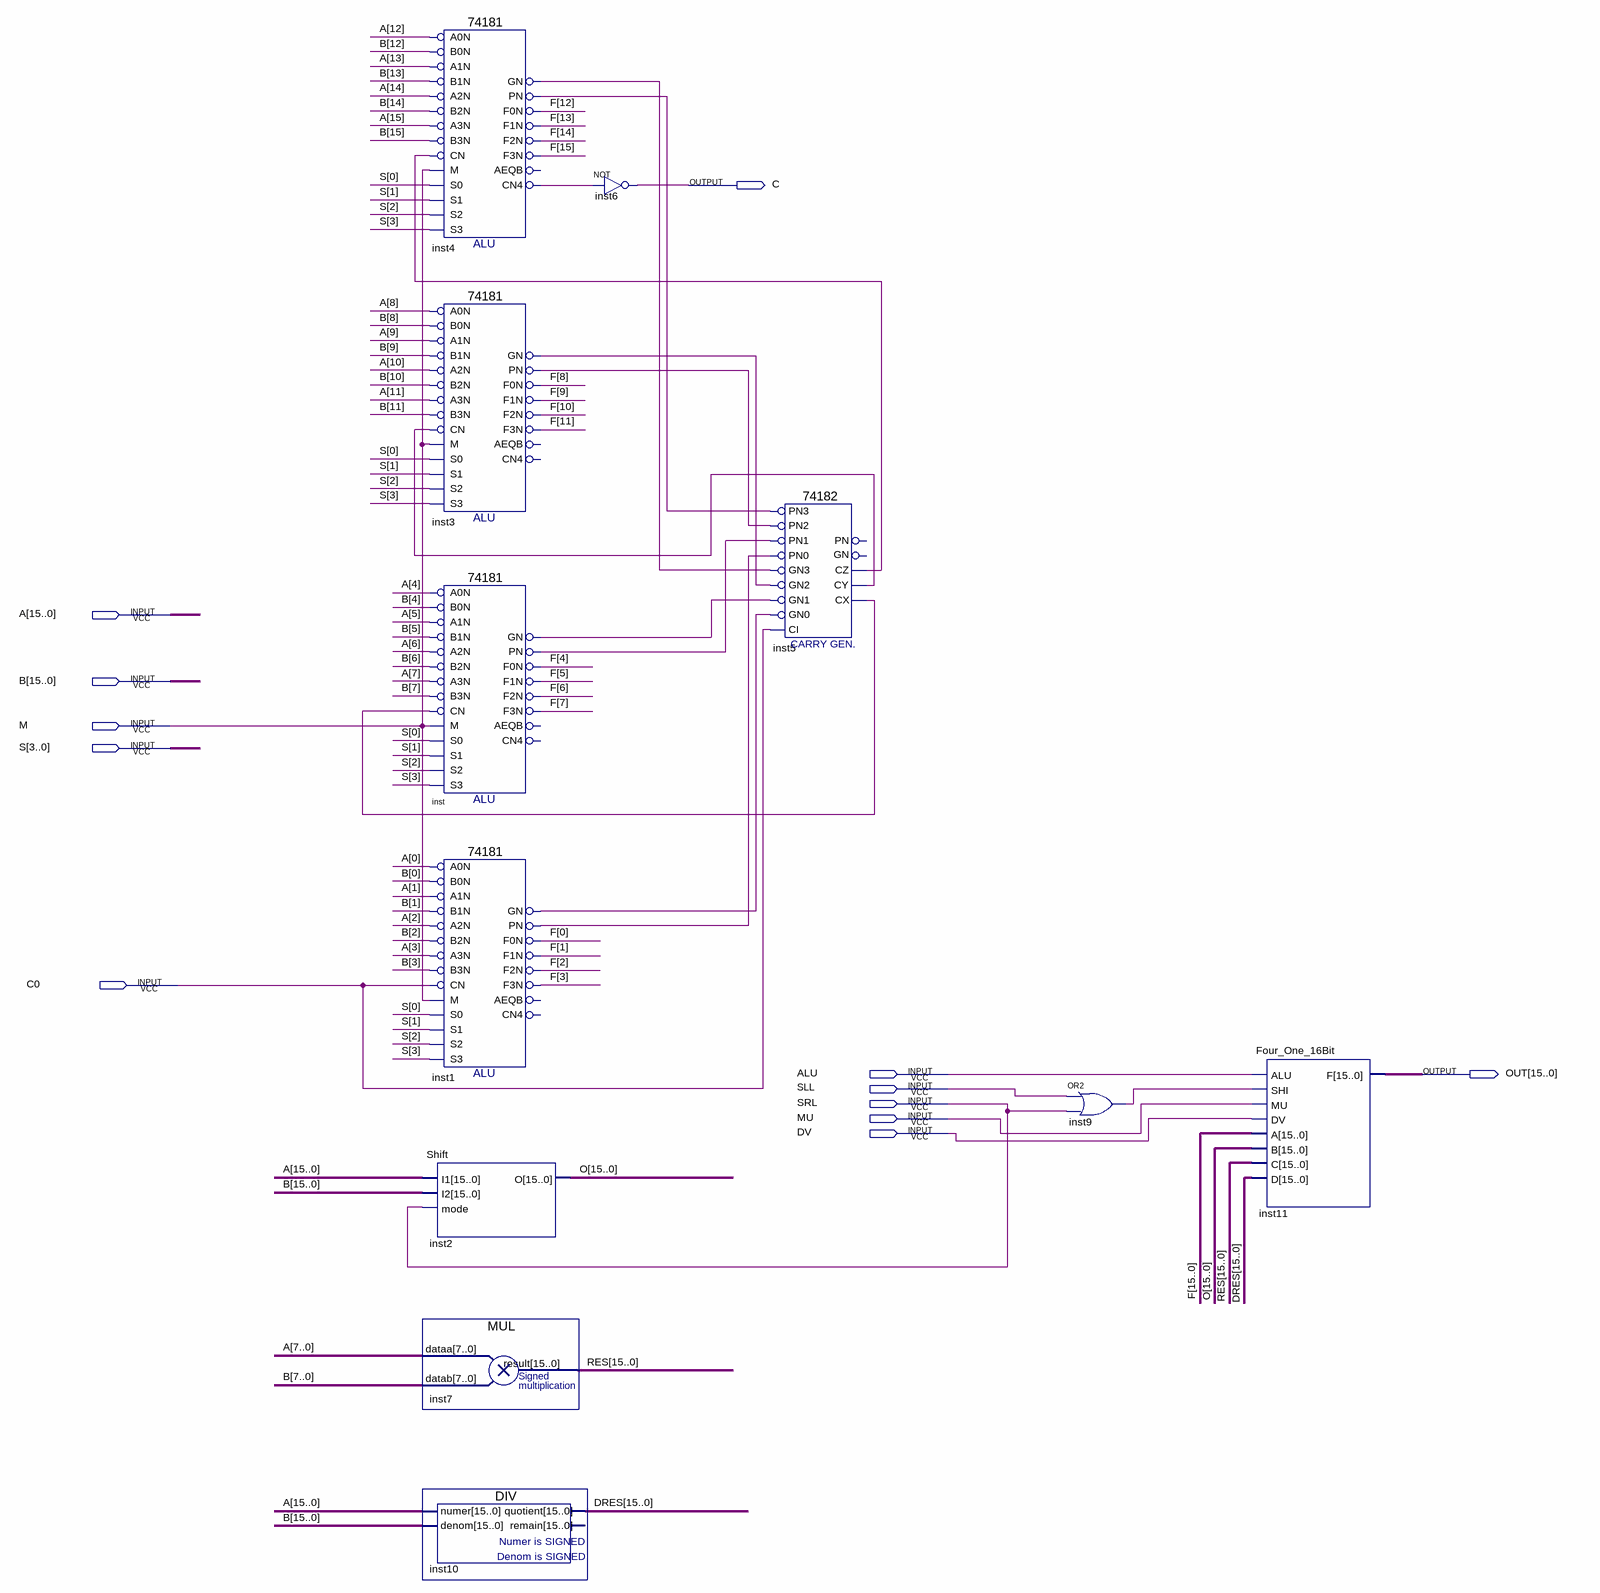
[diagram p0: schematic sheet]
// Quartus schematic 16_Bit_ALU.bdf as structural Verilog: 11 symbols, 12 pins
module \16_Bit_ALU  (
  input  [15:0] A,
  input  [15:0] B,
  input  M,
  input  [3:0] S,
  input  C0,
  input  ALU,
  input  SLL,
  input  SRL,
  input  MU,
  input  DV,
  output C,
  output [15:0] OUT
);

  wire inst1_gn, inst1_pn, inst3_gn, inst3_pn, inst4_cn4, inst4_gn, inst4_pn, inst5_cx, inst5_cy, inst5_cz,
       inst9_out, inst_gn, inst_pn;
  wire [15:0] DRES, F, O, RES;

  \74181  inst4 (
    .B0N(B[12]), .A0N(A[12]), .A1N(A[13]), .B1N(B[13]), .A3N(A[15]), .B2N(B[14]), .A2N(A[14]), .M(M),
    .CN(inst5_cz), .B3N(B[15]), .S2(S[2]), .S1(S[1]), .S0(S[0]), .S3(S[3]), .PN(inst4_pn), .GN(inst4_gn),
    .F3N(F[15]), .F1N(F[13]), .F0N(F[12]), .CN4(inst4_cn4), .F2N(F[14]));  // open: AEQB
  \74181  inst3 (
    .B0N(B[8]), .A0N(A[8]), .A1N(A[9]), .B1N(B[9]), .A3N(A[11]), .B2N(B[10]), .A2N(A[10]), .M(M),
    .CN(inst5_cy), .B3N(B[11]), .S2(S[2]), .S1(S[1]), .S0(S[0]), .S3(S[3]), .PN(inst3_pn), .GN(inst3_gn),
    .F3N(F[11]), .F1N(F[9]), .F0N(F[8]), .F2N(F[10]));  // open: AEQB, CN4
  \74181  inst (
    .B0N(B[4]), .A0N(A[4]), .A1N(A[5]), .B1N(B[5]), .A3N(A[7]), .B2N(B[6]), .A2N(A[6]), .M(M), .CN(inst5_cx),
    .B3N(B[7]), .S2(S[2]), .S1(S[1]), .S0(S[0]), .S3(S[3]), .PN(inst_pn), .GN(inst_gn), .F3N(F[7]),
    .F1N(F[5]), .F0N(F[4]), .F2N(F[6]));  // open: AEQB, CN4
  \74181  inst1 (
    .B0N(B[0]), .A0N(A[0]), .A1N(A[1]), .B1N(B[1]), .A3N(A[3]), .B2N(B[2]), .A2N(A[2]), .M(M), .CN(C0),
    .B3N(B[3]), .S2(S[2]), .S1(S[1]), .S0(S[0]), .S3(S[3]), .PN(inst1_pn), .GN(inst1_gn), .F3N(F[3]),
    .F1N(F[1]), .F0N(F[0]), .F2N(F[2]));  // open: AEQB, CN4
  Shift inst2 (.I1(A), .I2(B), .mode(SRL), .O(O));
  MUL inst7 (.dataa(A[7:0]), .datab(B[7:0]), .result(RES));
  DIV inst10 (.numer(A), .denom(B), .quotient(DRES));  // open: remain
  not inst6 (C, inst4_cn4);
  \74182  inst5 (
    .PN2(inst3_pn), .GN2(inst3_gn), .GN3(inst4_gn), .PN3(inst4_pn), .CI(C0), .PN1(inst_pn), .PN0(inst1_pn),
    .GN1(inst_gn), .GN0(inst1_gn), .CY(inst5_cy), .CX(inst5_cx), .CZ(inst5_cz));  // open: PN, GN
  or inst9 (inst9_out, SLL, SRL);
  Four_One_16Bit inst11 (.ALU(ALU), .SHI(inst9_out), .MU(MU), .DV(DV), .A(F), .B(O), .C(RES), .D(DRES), .F(OUT));
endmodule
